# EAGLE design Modul sterujacy nastawnika (EAGLE 5.09)
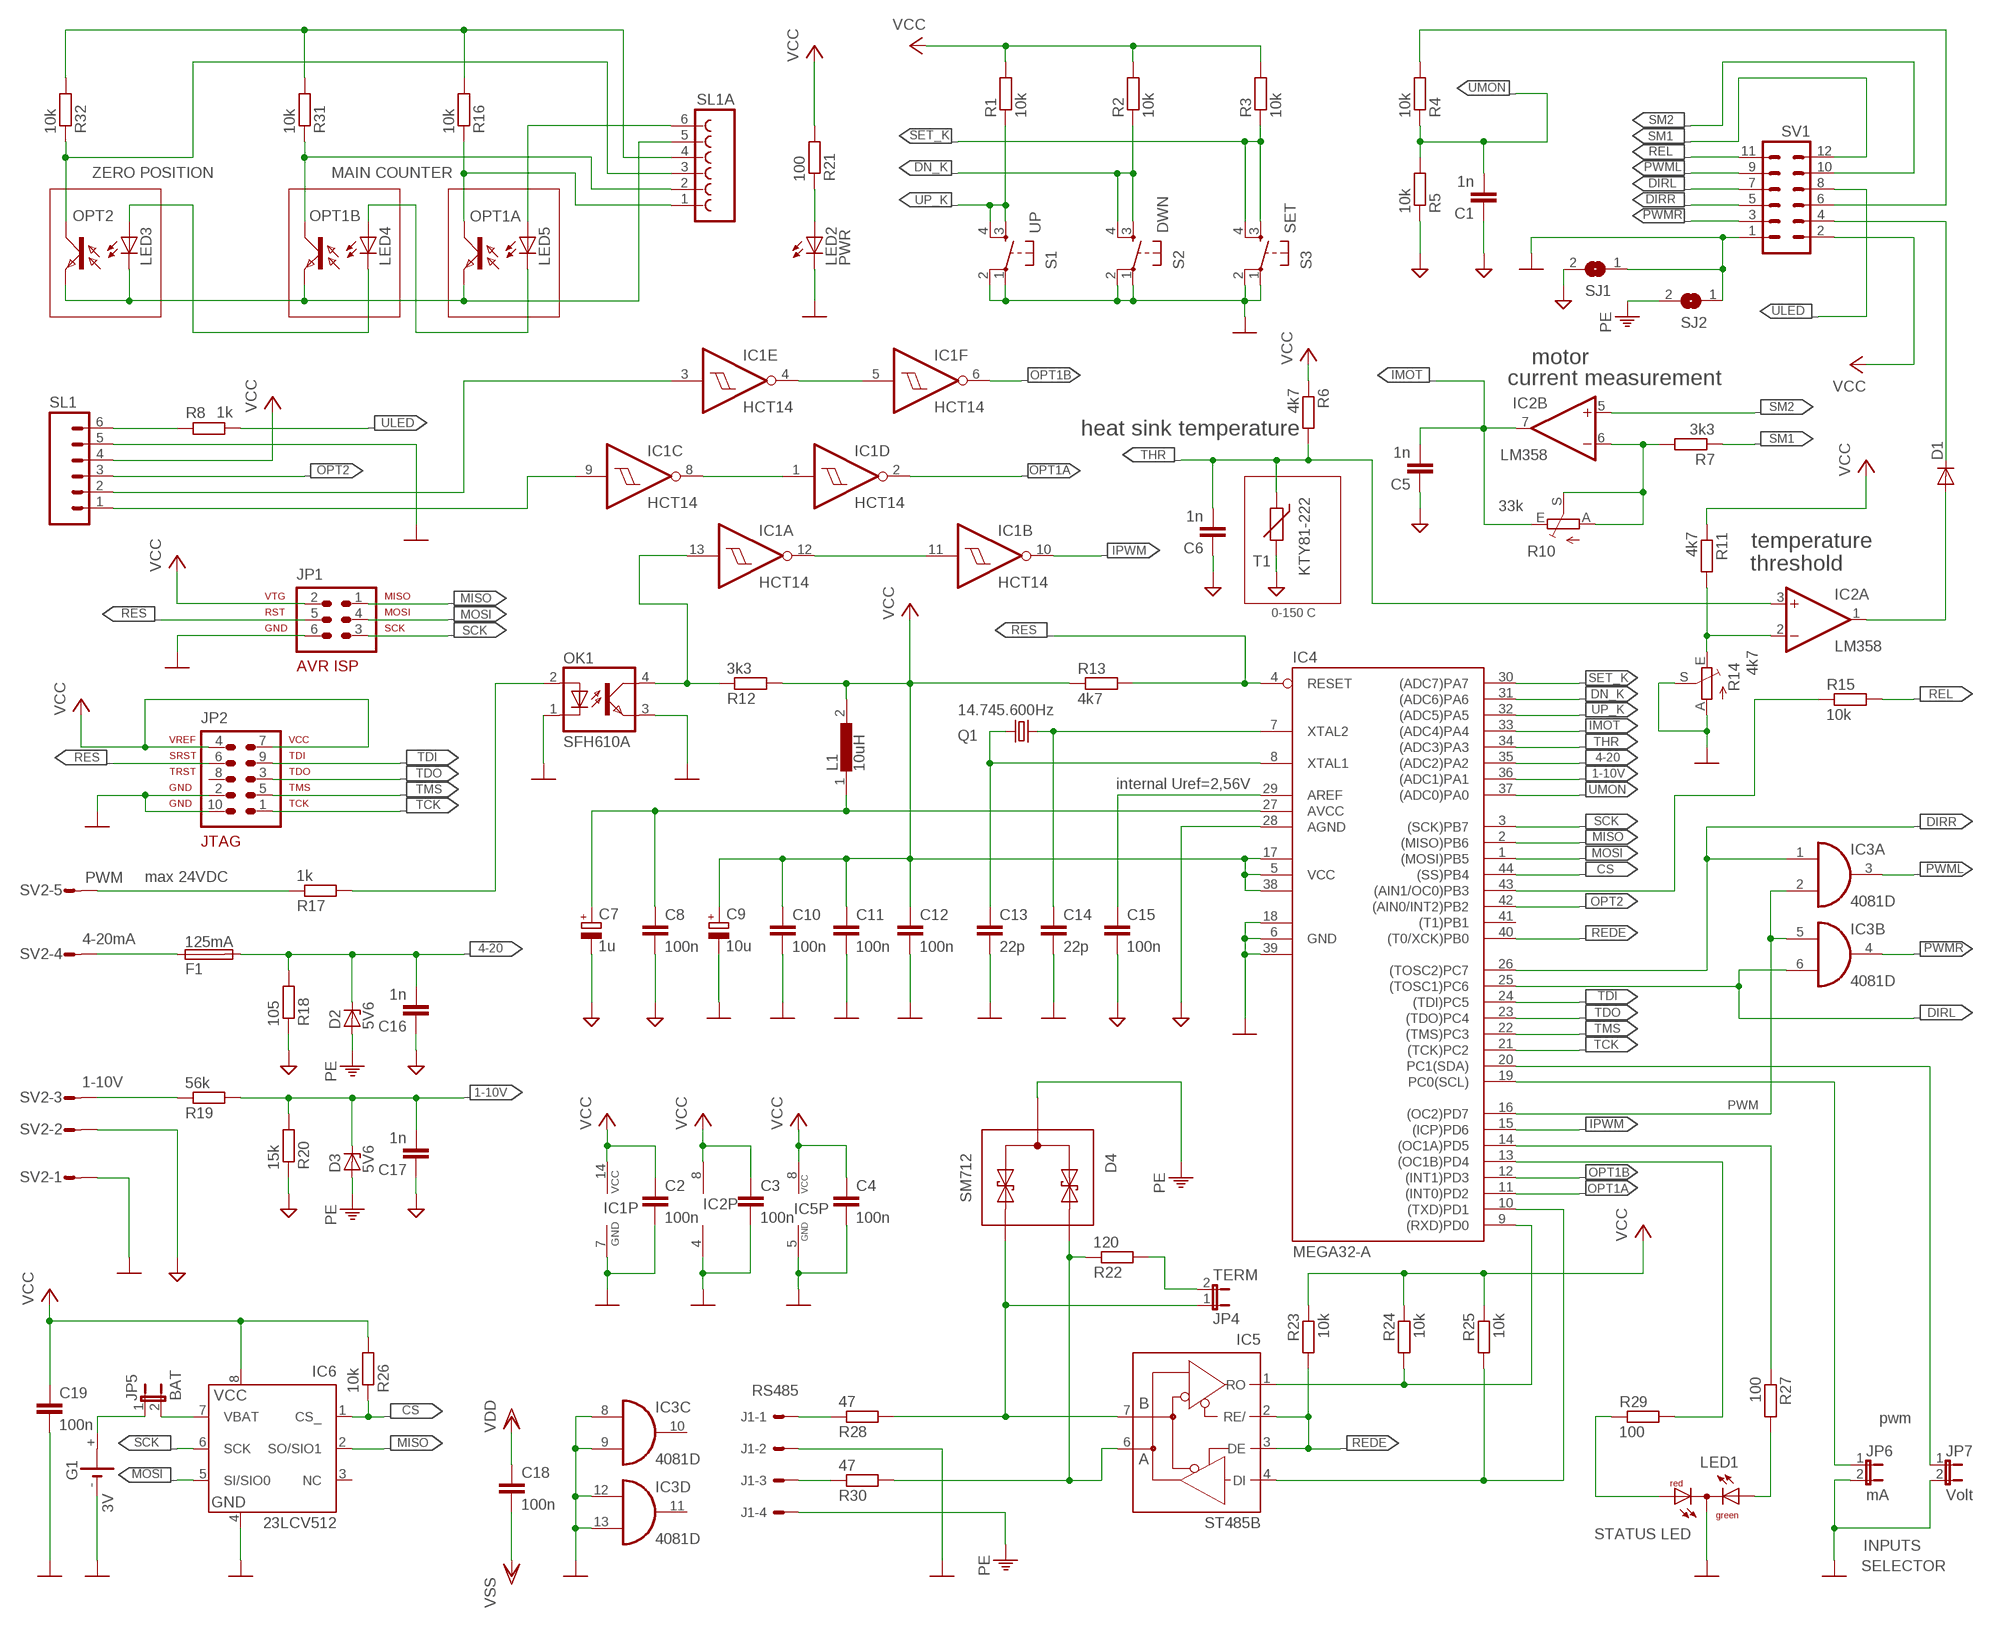
[diagram p0: schematic, sheet 1]

## Parts
C1  1n  C-EUC0805  [C0805]
C2  100n  C-EUC0805  [C0805]
C3  100n  C-EUC0805  [C0805]
C4  100n  C-EUC0805  [C0805]
C5  1n  C-EUC0805  [C0805]
C6  1n  C-EUC0805  [C0805]
C7  1u  CPOL-EUSMCP  [SMC_P]
C8  100n  C-EUC0805  [C0805]
C9  10u  CPOL-EUSMCC  [SMC_C]
C10  100n  C-EUC0805  [C0805]
C11  100n  C-EUC0805  [C0805]
C12  100n  C-EUC0805  [C0805]
C13  22p  C-EUC0805  [C0805]
C14  22p  C-EUC0805  [C0805]
C15  100n  C-EUC0805  [C0805]
C16  1n  C-EUC0805  [C0805]
C17  1n  C-EUC0805  [C0805]
C18  100n  C-EUC0805  [C0805]
C19  100n  C-EUC0805  [C0805]
D1  DIODE-MINIMELF  [MINIMELF]
D2  5V6  ZENER-DIODEMINIMELF  [MINIMELF]
D3  5V6  ZENER-DIODEMINIMELF  [MINIMELF]
D4  SM712  [SOT23]
F1  125mA  F6332  [R6332]
G1  CR2032V  [CR2032V]
IC1  HCT14  74AC14D  [SO14]
IC2  LM358  LM358D  [SO08]
IC3  4081D  [SO14]
IC4  MEGA32-A  [TQFP44]
IC5  ST485B  MAX481CSA  [SO08]
IC6  23LCV512  23LVC  [SO-08]
J1  22-27-2041-04  [6410-04]
JP1  AVR-ISP-6  [AVR-ISP-6]
JP2  AVR-JTAG-10  [AVR-JTAG-10]
JP4  TERM  JP1E  [JP1]
JP5  BAT  JP1E  [JP1]
JP6  mA  JP1E  [JP1]
JP7  Volt  JP1E  [JP1]
L1  10uH  1210  [C1210]
LED1  DUOLED-RG-C  [DUOLED-C-5MM]
LED2  PWR  LEDCHIPLED_1206  [CHIPLED_1206]
LED3  LEDIRL80A  [IRL80A]
LED4  LEDIRL80A  [IRL80A]
LED5  LEDIRL80A  [IRL80A]
OK1  SFH610A  SFH611  [DIL04]
OPT1A  LPT80A  [LPT80A]
OPT1B  LPT80A  [LPT80A]
OPT2  LPT80A  [LPT80A]
Q1  14.745.600Hz  CRYSTALSM49  [SM49]
R1  10k  R-EU_M0805  [M0805]
R2  10k  R-EU_M0805  [M0805]
R3  10k  R-EU_M0805  [M0805]
R4  10k  R-EU_R0805  [R0805]
R5  10k  R-EU_R0805  [R0805]
R6  4k7  R-EU_M0805  [M0805]
R7  3k3  R-EU_M0805  [M0805]
R8  1k  R-EU_M0805  [M0805]
R10  33k  TRIM_EU-B25P  [B25P]
R11  4k7  R-EU_M0805  [M0805]
R12  3k3  R-EU_M0805  [M0805]
R13  4k7  R-EU_M0805  [M0805]
R14  4k7  TRIM_EU-B25P  [B25P]
R15  10k  R-EU_M0805  [M0805]
R16  10k  R-EU_R0805  [R0805]
R17  1k  R-EU_M0805  [M0805]
R18  105  R-EU_M0805  [M0805]
R19  56k  R-EU_M0805  [M0805]
R20  15k  R-EU_M0805  [M0805]
R21  100  R-EU_M0805  [M0805]
R22  120  R-EU_M0805  [M0805]
R23  10k  R-EU_M0805  [M0805]
R24  10k  R-EU_M0805  [M0805]
R25  10k  R-EU_M0805  [M0805]
R26  10k  R-EU_M0805  [M0805]
R27  100  R-EU_M0805  [M0805]
R28  47  R-EU_M0805  [M0805]
R29  100  R-EU_M0805  [M0805]
R30  47  R-EU_M0805  [M0805]
R31  10k  R-EU_R0805  [R0805]
R32  10k  R-EU_R0805  [R0805]
S1  UP  DTS-6  [DTS-6]
S2  DWN  DTS-6  [DTS-6]
S3  SET  DTS-6  [DTS-6]
SJ1  SJ  [SJ]
SJ2  SJ  [SJ]
SL1  M06  [06P]
SL1A  F06  [06P]
SV1  MA06-2  [MA06-2]
SV2  S05P  [S05P]
T1  KTY81-222  THERMISTOR-2,5  [RS-2,5]

## Nets
1-10_I: R19.1 SV2.3
1-10V: C17.2 D3.C IC4.36((ADC1)PA1) R19.2 R20.2
4-20: C16.2 D2.C F1.2 IC4.35((ADC2)PA2) R18.2
4-20_I: F1.1 SV2.4
AGND: C1.1 C5.1 C6.1 C7.- C8.2 C15.2 C16.1 C17.1 IC4.28(AGND) R5.1 R18.1 R20.1 SJ1.2 SV2.2 T1.2
CS: IC4.44((SS)PB4) IC6.1(CS_) R26.1
DIRL: IC3.6(B:I1) IC4.25((TOSC1)PC6) SV1.7
DIRR: IC3.1(A:I0) IC4.26((TOSC2)PC7) SV1.5
DN_K: IC4.31((ADC6)PA6) R2.1 S2.3 S2.4
GND: C2.2 C3.2 C4.2 C9.- C10.2 C11.2 C12.2 C13.2 C14.2 C19.2 G1.- IC1.7(P:GND) IC2.4(P:V-) IC3.8(C:I0) IC3.9(C:I1) IC3.12(D:I0) IC3.13(D:I1) IC4.6(GND) IC4.18(GND1) IC4.39(GND2) IC5.5(GND) IC6.4(GND) J1.2 JP1.6 JP2.2 JP2.10 JP6.2 JP7.2 LED1.C LED2.C OK1.1(C) OK1.3(EMIT) R14.A R14.S S1.1 S1.2 S2.1 S2.2 S3.1 S3.2 SJ1.1 SJ2.1 SL1.5 SV1.1 SV2.1
IMOT: C5.2 IC2.7(B:OUT) IC4.33((ADC4)PA4) R10.E
IPWM: IC1.10(B:O) IC4.15((ICP)PD6)
MISO: IC4.2((MISO)PB6) IC6.2(SO/SIO1) JP1.1
MOSI: IC4.1((MOSI)PB5) IC6.5(SI/SIO0) JP1.4
N$1: IC4.43((AIN1/OC0)PB3) R15.1
N$2: IC2.6(B:-IN) R7.2 R10.A R10.S
N$3: R4.2 SV1.6
N$4: R17.1 SV2.5
N$5: LED3.A LED4.K(C)
N$6: J1.1 R28.1
N$7: LED5.A SL1A.6
N$8: IC1.9(C:I) SL1.1
N$11: D1.C SV1.4
N$12: J1.3 R30.1
N$14: JP4.2 R22.2
N$16: IC2.2(A:-IN) R11.2 R14.E
N$17: D4.1 IC5.7(B) JP4.1 R28.2
N$21: D4.2 IC5.6(A) R22.1 R30.2
N$22: IC4.20(PC1(SDA)) JP7.1
N$23: IC4.19(PC0(SCL)) JP6.1
N$24: IC4.14((OC1A)PD5) R27.1
N$26: LED1.AX(AG) R27.2
N$27: IC4.13((OC1B)PD4) R29.2
N$28: LED1.AR R29.1
N$33: C14.1 IC4.7(XTAL2) Q1.2
N$34: C7.+ C8.1 IC4.27(AVCC) L1.1
N$35: LED2.A R21.1
N$36: D1.A IC2.1(A:OUT)
N$37: C13.1 IC4.8(XTAL1) Q1.1
N$42: G1.+ JP5.1
N$43: IC1.11(B:I) IC1.12(A:O)
N$44: IC1.1(D:I) IC1.8(C:O)
N$45: IC1.3(E:I) SL1.2
N$46: IC1.4(E:O) IC1.5(F:I)
N$47: R8.1 SL1.6
N$48: R16.2 R31.2 R32.2 SL1A.4
N$49: OK1.2(A) R17.2
N$50: LED4.A LED5.K(C)
N$51: IC1.13(A:I) OK1.4(COL) R12.1
N$52: OPT1A.C R16.1 SL1A.1
N$53: OPT1B.C R31.1 SL1A.2
N$54: IC6.7(VBAT) JP5.2
N$55: OPT2.C R32.1 SL1A.3
N$56: IC4.10((TXD)PD1) IC5.4(DI) R25.2
N$58: LED3.K(C) OPT1A.E OPT1B.E OPT2.E SL1A.5
N$60: C15.1 IC4.29(AREF)
N$61: IC4.9((RXD)PD0) IC5.1(RO) R24.2
OPT1A: IC1.2(D:O) IC4.11((INT0)PD2)
OPT1B: IC1.6(F:O) IC4.12((INT1)PD3)
OPT2: IC4.42((AIN0/INT2)PB2) SL1.3
PE: D2.A D3.A D4.3 J1.4 SJ2.2
PWML: IC3.3(A:O) SV1.9
PWMO: IC3.2(A:I1) IC3.5(B:I0) IC4.16((OC2)PD7)
PWMR: IC3.4(B:O) SV1.3
REDE: IC4.40((T0/XCK)PB0) IC5.2(RE/) IC5.3(DE) R23.2
REL: R15.2 SV1.11
RES: IC4.4(RESET) JP1.5 JP2.6 R13.2
SCK: IC4.3((SCK)PB7) IC6.6(SCK) JP1.3
SET_K: IC4.30((ADC7)PA7) R3.1 S3.3 S3.4
SM1: R7.1 SV1.12
SM2: IC2.5(B:+IN) SV1.10
TCK: IC4.21((TCK)PC2) JP2.1
TDI: IC4.24((TDI)PC5) JP2.9
TDO: IC4.23((TDO)PC4) JP2.3
THR: C6.2 IC2.3(A:+IN) IC4.34((ADC3)PA3) R6.2 T1.1
TMS: IC4.22((TMS)PC3) JP2.5
ULED: R8.2 SV1.8
UMON: C1.2 IC4.37((ADC0)PA0) R4.1 R5.2
UP_K: IC4.32((ADC5)PA5) R1.1 S1.3 S1.4
VCC: C2.1 C3.1 C4.1 C9.+ C10.1 C11.1 C12.1 C19.1 IC1.14(P:VCC) IC2.8(P:V+) IC4.5(VCC) IC4.17(VCC1) IC4.38(VCC2) IC5.8(VCC) IC6.8(VCC) JP1.2 JP2.4 JP2.7 L1.2 R1.2 R2.2 R3.2 R6.1 R11.1 R12.2 R13.1 R21.2 R23.1 R24.1 R25.1 R26.2 SL1.4 SV1.2
VDD: C18.1
VSS: C18.2
Unconnected: G1.+@1(+) IC3.10(C:O) IC3.11(D:O) IC4.41((T1)PB1) IC6.3(NC) JP2.8

## Notes on the sheet
- ZERO POSITION | MAIN COUNTER
- motor
- current measurement
- heat sink temperature
- temperature
- threshold
- 0-150 C
- internal Uref=2,56V
- PWM | max 24VDC
- 4-20mA
- 1-10V
- PWM
- IC2P
- RS485
- pwm
- 3V
- STATUS LED
- INPUTS
- SELECTOR

## Power pins joined to a net without a drawn wire
VDD: IC3.14(P:VDD)
VSS: IC3.7(P:VSS)

## Library data of the parts
C1-C6 C8 C10-C19 = rcl:C-EU: CAPACITOR, European symbol
C7 C9 = rcl:CPOL-EU: POLARIZED CAPACITOR, European symbol
D1 = diode:DIODE-: DIODE
D2 D3 = diode:ZENER-DIODEMINIMELF
D4 = diode:SM712: Suppressor (TVS) diode - Asymmetrical TVS Diode for Extended Common-Mode RS-485
F1 = fuse:F6332
G1 = battery:CR2032V: LI BATTERY Varta
IC1 = 74xx-eu:74*14: Hex schmitt trigger INVERTER
IC2 = linear:LM358: OP AMP also LM158; LM258; LM2904 Source: http://cache.national.com/ds/LM/LM158.pdf
IC3 = 40xx:4081: Quad 2-input AND
IC4 = avr:MEGA32: MICROCONTROLLER 32 Kbytes FLASH 2 Kbytes SRAM 1 Kbytes EEPROM USART 8-channel 10 bit ADC
IC5 = maxim-7:MAX481CSA: RS485 TRANSEIVER
IC6 = microchip:23LVC: 512 Kbit SPI Serial SRAM with Battery Backup and SDI Interface
J1 = con-molex:22-?-04: CONNECTOR wire to board 2.54 mm (.1 inch) pitch header
JP1 = atmel1:AVR-ISP-6: AVR ISP-6 Serial Programming Header
JP2 = atmel1:AVR-JTAG-10: AVR JTAG Debug/Programming Header
JP4-JP7 = jumper:JP1E: JUMPER
L1 = inductors:1210
LED1 = led:DUOLED-RG-C: DUO LED 2 colors (red/green), 5 mm, round, common Cathode www.ligitek.com or other producers.
LED2-LED5 = led:LED: LED OSRAM: - CHIPLED LG R971, LG N971, LY N971, LG Q971, LY Q971, LO R971, LY R971 LH N974, LH R974 LS Q976, LO Q976, LY Q976 LO Q996 - Hyper CHIPLED LW Q18S LB Q993, LB Q99A, LB R99A - SideLED LS A670, LO A670, LY A670, LG A670, LP A670 LB A673, LV A673, LT A673, LW A673 LH A674 LY A675 LS A676, LA A676, LO A676, LY A676, LW A676 LS A679, LY A679, LG A679 - Hyper Micro SIDELED® LS Y876, LA Y876, LO Y876, LY Y876 LT Y87S - SmartLED LW L88C, LW L88S LB L89C, LB L89S, LG L890 LS L89K, LO L89K, LY L89K LS L896, LA L896, LO L896, LY L896 - TOPLED LS T670, LO T670, LY T670, LG T670, LP T670 LSG T670, LSP T670, LSY T670, LOP T670, LYG T670 LG T671, LOG T671, LSG T671 LB T673, LV T673, LT T673, LW T673 LH T674 LS T676, LA T676, LO T676, LY T676, LB T676, LH T676, LSB T676, LW T676 LB T67C, LV T67C, LT T67C, LS T67K, LO T67K, LY T67K, LW E67C LS E67B, LA E67B, LO E67B, LY E67B, LB E67C, LV E67C, LT E67C LW T67C LS T679, LY T679, LG T679 LS T770, LO T770, LY T770, LG T770, LP T770 LB T773, LV T773, LT T773, LW T773 LH T774 LS E675, LA E675, LY E675, LS T675 LS T776, LA T776, LO T776, LY T776, LB T776 LHGB T686 LT T68C, LB T68C - Hyper Mini TOPLED® LB M676 - Mini TOPLED Santana® LG M470 LS M47K, LO M47K, LY M47K Source: http://www.osram.convergy.de LUXEON: - LUMILED® LXK2-PW12-R00, LXK2-PW12-S00, LXK2-PW14-U00, LXK2-PW14-V00 LXK2-PM12-R00, LXK2-PM12-S00, LXK2-PM14-U00 LXK2-PE12-Q00, LXK2-PE12-R00, LXK2-PE12-S00, LXK2-PE14-T00, LXK2-PE14-U00 LXK2-PB12-K00, LXK2-PB12-L00, LXK2-PB12-M00, LXK2-PB14-N00, LXK2-PB14-P00, LXK2-PB14-Q00 LXK2-PR12-L00, LXK2-PR12-M00, LXK2-PR14-Q00, LXK2-PR14-R00 LXK2-PD12-Q00, LXK2-PD12-R00, LXK2-PD12-S00 LXK2-PH12-R00, LXK2-PH12-S00 LXK2-PL12-P00, LXK2-PL12-Q00, LXK2-PL12-R00 Source: www.luxeon.com KINGBRIGHT: KA-3528ASYC Source: www.kingbright.com
OK1 = optocoupler:SFH611: SIEMENS OPTO COUPLER
OPT1A OPT1B OPT2 = opto-trans-siemens:LPT80A: PHOTO TRANSISTOR
Q1 = crystal:CRYSTAL: CRYSTAL
R1-R8 R11-R13 R15-R32 = rcl:R-EU_: RESISTOR, European symbol
R10 R14 = pot:TRIM_EU-: POTENTIOMETER
S1-S3 = switch-tact1:DTS-6
SJ1 SJ2 = jumper:SJ: SMD solder JUMPER
SL1 = con-amp-quick:M06: AMP QUICK CONNECTOR
SL1A = con-amp-quick:F06: AMP QUICK CONNECTOR - female
SV1 = con-lstb:MA06-2: PIN HEADER
SV2 = con-amp-mt:S05P: AMP MT CONNECTOR
T1 = varistor:THERMISTOR: THERMISTOR

## Board
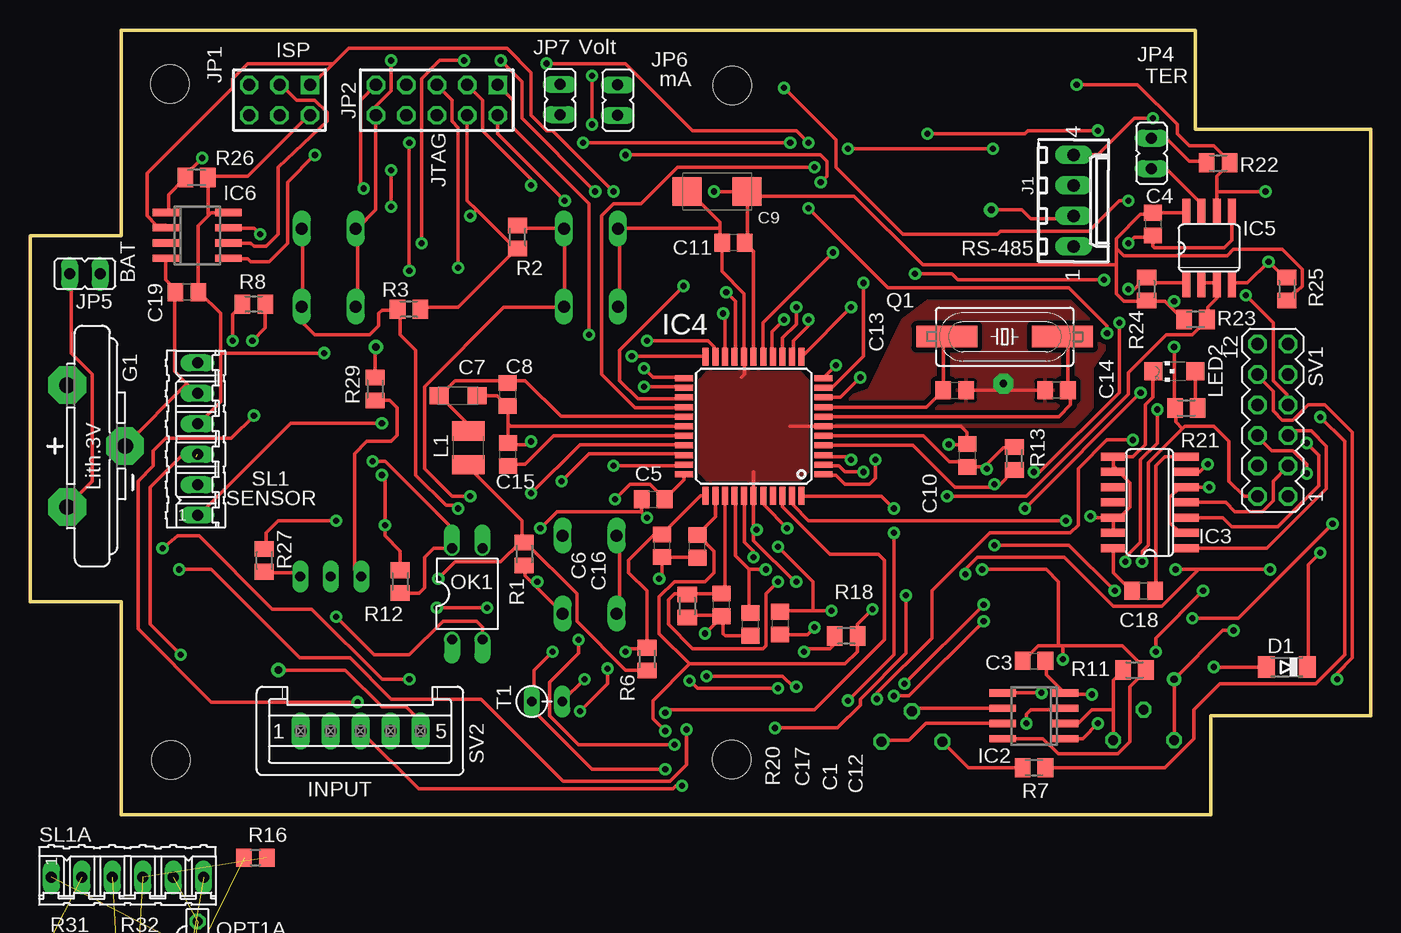
[diagram p1: board, top side]
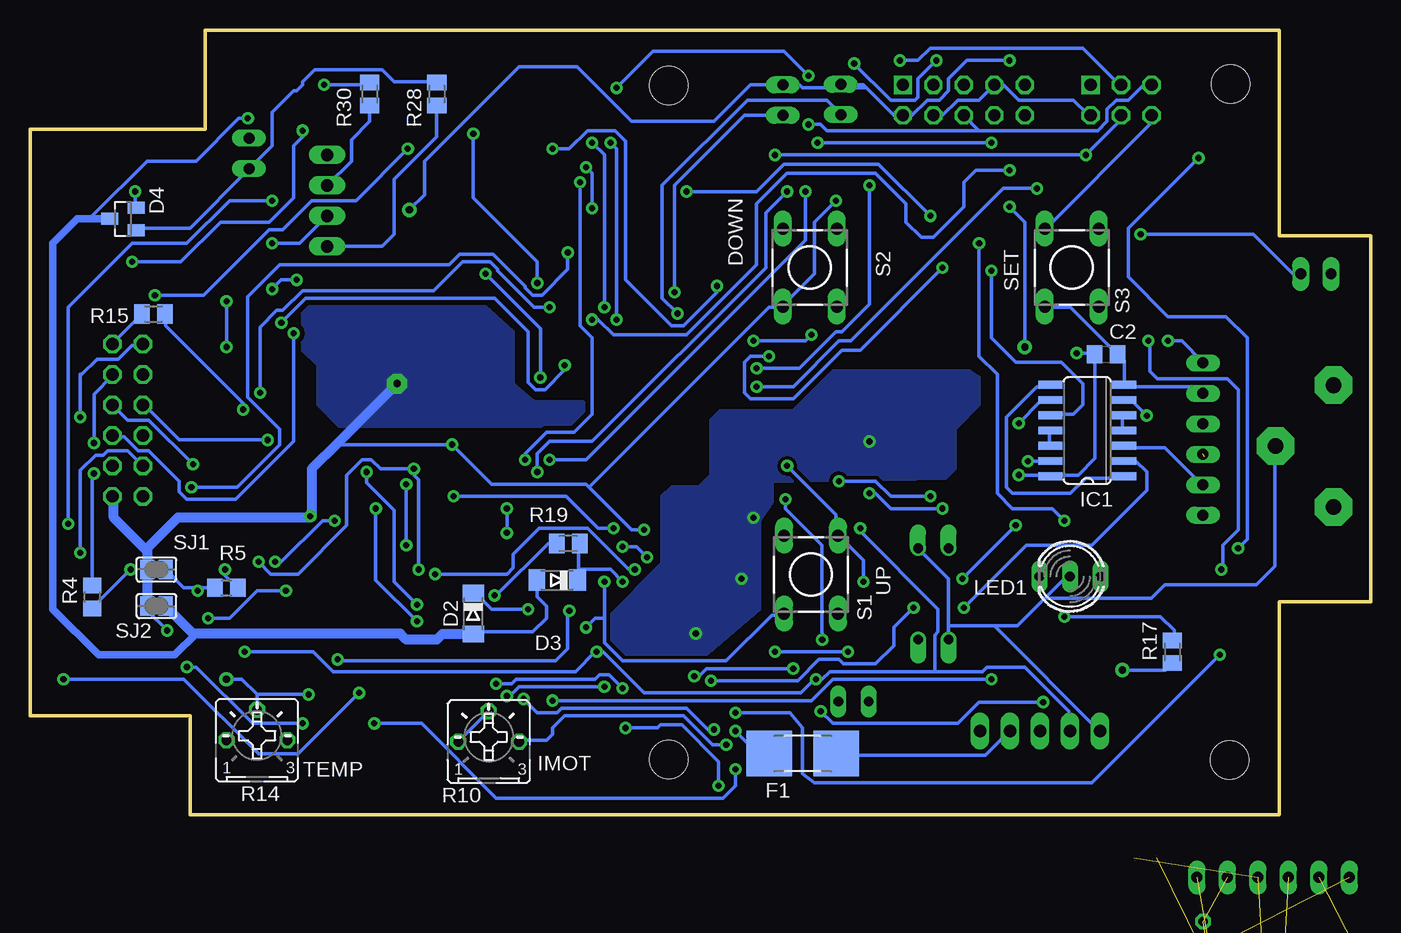
[diagram p2: board, bottom side, seen from below]

Size 111.76 x 65.53 mm. Coordinates in mm from the lower left corner, seen from the top.
Outline: 98.42,0.13 98.42,0
Outline: 98.42,0.13 7.62,0.13 7.62,17.91 0,17.91 0,48.39 7.62,48.39 7.62,65.53 97.16,65.53 97.16,57.28 111.76,57.28 111.76,8.38 98.42,8.38 98.42,0.13
Copper layers (1*16): Top 0.035mm / dielectric 1.55mm / Bottom 0.035mm
Design rules "cntr *": minimum track width 12mil, minimum drill 20mil, track to track 12mil, track to pad 10mil, pad to pad 8mil, via to via 12mil, smd to smd 8mil, copper to edge 40mil, drill to drill 20mil, minimum pad ring 10mil, minimum via ring 8mil, stop-mask expansion 4mil, vias tented up to drill 0mil, thermal gap 10mil
Holes 3.2 mm at 11.67,61.02 11.77,4.71 58.53,60.9 58.51,4.73
tRestrict: area 8.2,57.5 to 15.1,64.4; area 55.2,57.5 to 62.1,64.4; area 55.2,1.5 to 62.1,8.4; area 8.5,1.3 to 15.4,8.2

### Footprints (pad centres in the part's own frame; a part is rotated, then mirrored left to right if it is on the bottom)
C0805 = smd 1.3 x 1.5: 1 -0.95,0; 2 0.95,0
SMC_P = smd 1.6 x 1.4: + -1.575,0; - 1.575,0
SMC_C = smd 2.4 x 2.4: + -2.5,0; - 2.5,0
MINIMELF = smd 1.4 x 1.8: A 1.7,0; C -1.7,0
SOT23 = smd 1 x 1.4: 1 -0.95,-1.1; 2 0.95,-1.1; 3 0,1.1
R6332 = smd 3.81 x 3.81: 1 -2.8,0; 2 2.8,0
CR2032V = drill 1.321 pad 3.15 octagon: + -2.54,-5.08; +@1 -2.54,5.08; - 2.286,0
SO14 = smd 0.66 x 2.032: 1 -3.81,-3.073; 2 -2.54,-3.073; 3 -1.27,-3.073; 4 0,-3.073; 5 1.27,-3.073; 6 2.54,-3.073; 7 3.81,-3.073; 8 3.81,3.073; 9 2.54,3.073; 10 1.27,3.073; 11 0,3.073; 12 -1.27,3.073; 13 -2.54,3.073; 14 -3.81,3.073
SO08 = smd 0.6 x 2.2: 1 -1.905,-2.6; 2 -0.635,-2.6; 3 0.635,-2.6; 4 1.905,-2.6; 5 1.905,2.6; 6 0.635,2.6; 7 -0.635,2.6; 8 -1.905,2.6
TQFP44 = smd 1.5 x 0.5: 1 -5.8,4; 2 -5.8,3.2; 3 -5.8,2.4; 4 -5.8,1.6; 5 -5.8,0.8; 6 -5.8,0; 7 -5.8,-0.8; 8 -5.8,-1.6; 9 -5.8,-2.4; 10 -5.8,-3.2; 11 -5.8,-4; 23 5.8,-4; 24 5.8,-3.2; 25 5.8,-2.4; 26 5.8,-1.6; 27 5.8,-0.8; 28 5.8,0; 29 5.8,0.8; 30 5.8,1.6; 31 5.8,2.4; 32 5.8,3.2; 33 5.8,4 | smd 0.5 x 1.5: 12 -4,-5.8; 13 -3.2,-5.8; 14 -2.4,-5.8; 15 -1.6,-5.8; 16 -0.8,-5.8; 17 0,-5.8; 18 0.8,-5.8; 19 1.6,-5.8; 20 2.4,-5.8; 21 3.2,-5.8; 22 4,-5.8; 34 4,5.8; 35 3.2,5.8; 36 2.4,5.8; 37 1.6,5.8; 38 0.8,5.8; 39 0,5.8; 40 -0.8,5.8; 41 -1.6,5.8; 42 -2.4,5.8; 43 -3.2,5.8; 44 -4,5.8
SO08' = smd 0.66 x 2.032: 1 -1.905,-3.073; 2 -0.635,-3.073; 3 0.635,-3.073; 4 1.905,-3.073; 5 1.905,3.073; 6 0.635,3.073; 7 -0.635,3.073; 8 -1.905,3.073
SO-08 = smd 0.6 x 2.2: 1 -1.905,-2.6; 2 -0.635,-2.6; 3 0.635,-2.6; 4 1.905,-2.6; 5 1.905,2.6; 6 0.635,2.6; 7 -0.635,2.6; 8 -1.905,2.6
6410-04 = drill 1.016 long: 1 3.81,0; 2 1.27,0; 3 -1.27,0; 4 -3.81,0
AVR-ISP-6 = drill 1.016 square: 1 -2.54,-1.27 | drill 1.016 octagon: 2 -2.54,1.27; 3 0,-1.27; 4 0,1.27; 5 2.54,-1.27; 6 2.54,1.27
AVR-JTAG-10 = drill 1.016 square: 1 -5.08,-1.27 | drill 1.016 octagon: 2 -5.08,1.27; 3 -2.54,-1.27; 4 -2.54,1.27; 5 0,-1.27; 6 0,1.27; 7 2.54,-1.27; 8 2.54,1.27; 9 5.08,-1.27; 10 5.08,1.27
JP1 = drill 0.914 long: 1 0,-1.27; 2 0,1.27
C1210 = smd 1.6 x 2.7: 1 -1.4,0; 2 1.4,0
DUOLED-C-5MM = drill 0.813 long: AR 2.54,0; AX -2.54,0; C 0,0
CHIPLED_1206 = smd 1.5 x 1.5: A 0,-1.75; C 0,1.75
IRL80A = drill 0.813 octagon: A 0,-1.27; K 0,1.27
DIL04 = drill 0.813 offset: 1 -1.27,-3.81; 2 1.27,-3.81; 3 1.27,3.81; 4 -1.27,3.81
LPT80A = drill 0.813 octagon: C 0,-1.27; E 0,1.27
SM49 = smd 5.08 x 1.778: 1 -4.826,0; 2 4.826,0
M0805 = smd 1.3 x 1.6: 1 -0.95,0; 2 0.95,0
R0805 = smd 1.3 x 1.5: 1 -0.95,0; 2 0.95,0
B25P = drill 0.813 octagon: A -2.54,0; E 2.54,0; S 0,2.54
DTS-6 = drill 1 long: 1 -3.25,2.25; 2 3.25,2.25; 3 -3.25,-2.25; 4 3.25,-2.25
SJ = smd 1.168 x 1.6: 1 -0.762,0; 2 0.762,0
06P = drill 0.914 long: 1 -6.35,0; 2 -3.81,0; 3 -1.27,0; 4 1.27,0; 5 3.81,0; 6 6.35,0
MA06-2 = drill 1.016 octagon: 1 -6.35,-1.27; 2 -6.35,1.27; 3 -3.81,-1.27; 4 -3.81,1.27; 5 -1.27,-1.27; 6 -1.27,1.27; 7 1.27,-1.27; 8 1.27,1.27; 9 3.81,-1.27; 10 3.81,1.27; 11 6.35,-1.27; 12 6.35,1.27
S05P = drill 1.016 long: 1 5,0; 2 2.5,0; 3 0,0; 4 -2.5,0; 5 -5,0
RS-2,5 = drill 0.813 long: 1 -1.27,0; 2 1.27,0

### Placement (x,y rotation side)
C1  60.07,16 90 top
C2  22.05,38.51 0 bottom
C3  83.69,12.95 0 top
C4  93.62,49.35 270 top
C5  51.94,26.42 0 top
C6  52.71,22.56 90 top
C7  35.69,35.05 0 top
C8  39.8,35.15 270 top
C9  57.28,52.07 180 top
C10  78.16,30.07 90 top
C11  58.65,47.8 180 top
C12  62.51,16.1 270 top
C13  77.09,35.51 0 top
C14  85.57,35.51 180 top
C15  39.85,30.15 90 top
C16  55.63,22.5 90 top
C17  57.63,17.63 90 top
C18  92.84,18.8 0 top
C19  13.08,43.69 180 top
D1  104.77,12.45 180 top
D2  74.8,16.89 270 bottom
D3  67.82,19.68 180 bottom
D4  104.01,49.78 90 bottom
F1  47.35,5.23 180 bottom
G1  5.64,30.86 0 top
IC1  23.62,32.16 90 bottom
IC2  83.69,8.38 90 top
IC3  93.34,26.16 90 top
IC4  60.33,32.51 180 top
IC5  ST485B  [SO08']  98.3,47.37 0 top
IC6  13.94,48.41 270 top
J1  86.99,51.31 270 top
JP1  20.8,59.69 180 top
JP2  33.91,59.69 180 top
JP4  93.5,55.24 0 top
JP5  4.57,45.21 270 top
JP6  49,59.69 0 top
JP7  44.17,59.74 0 top
L1  36.53,30.71 270 top
LED1  25.07,19.99 180 bottom
LED2  95.38,37.08 90 top
LED3  2.41,-26.67 0 top  (outside the outline)
LED4  2.29,-21.72 0 top  (outside the outline)
LED5  11.3,-21.72 0 top  (outside the outline)
OK1  36.45,18.54 0 top
OPT1A  13.97,-10.03 0 top  (outside the outline)
OPT1B  2.29,-16.76 0 top  (outside the outline)
OPT2  12.95,-16.76 0 top  (outside the outline)
Q1  81.25,39.98 0 top
R1  41.2,21.87 90 top
R2  40.64,48.29 270 top
R3  31.6,42.27 0 top
R4  106.55,18.29 90 bottom
R5  95.38,19.05 0 bottom
R6  51.44,13.11 90 top
R7  83.69,4.06 180 top
R8  18.67,42.67 0 top
R10  73.52,6.23 0 bottom
R11  92.07,12.19 180 top
R12  30.86,19.56 90 top
R13  82.07,29.82 270 top
R14  92.84,6.35 0 bottom
R15  101.47,41.86 180 bottom
R16  18.8,-3.43 0 top  (outside the outline)
R17  16.54,13.72 90 bottom
R18  68.05,15.04 0 top
R19  66.88,22.73 0 bottom
R20  54.79,17.53 90 top
R21  96.39,34.04 180 top
R22  99.03,54.46 180 top
R23  97.16,41.4 0 top
R24  93.09,43.94 90 top
R25  104.77,43.94 90 top
R26  13.89,53.24 0 top
R27  19.53,21.34 270 top
R28  77.85,60.2 90 bottom
R29  28.78,35.61 90 top
R30  83.44,60.2 90 bottom
R31  2.29,-10.92 0 top  (outside the outline)
R32  8.13,-10.92 0 top  (outside the outline)
S1  46.66,20.14 90 bottom
S2  46.76,45.73 90 bottom
S3  24.91,45.73 90 bottom
SJ1  101.22,20.57 0 bottom
SJ2  101.22,17.53 0 bottom
SL1  13.97,31.45 90 top
SL1A  8.13,-5.08 0 top  (outside the outline)
SV1  103.61,33.02 90 top
SV2  27.56,7.11 180 top
T1  43.1,9.58 0 top

### Tracks (layer width: path | path; a pad name or v marks a point on that pad's centre or on a via)
1-10_I  (via drill 0.51)
  Top 0.305: v73.02,18.41 73.02,13.59 69.22,9.78 69.22,9.27 67.31,7.37 v62.1,7.37 | v54.36,2.54 53.85,2.54 53.59,2.29 32.38,2.29 SV2.3
  Bottom 0.305: v73.02,18.41 72.9,18.41 68.58,22.73 R19.1 | v62.1,7.37 59.44,7.37 59.18,7.62 57.4,7.62 54.36,4.57 v54.36,2.54
1-10V  (via drill 0.51)
  Top 0.305: v62.36,19.56 61.34,18.54 61.34,14.22 61.09,13.97 55.25,13.97 53.21,16 53.21,18.03 53.72,18.54 54.72,18.54 R20.2 54.99,18.54 57.53,18.54 C17.2 57.93,18.87 IC4.36
  Bottom 0.305: R19.2 66.04,22.73 66.04,19.68 D3.C 65.91,20.57 63.37,20.57 v62.36,19.56
4-20  (via drill 0.51)
  Top 0.305: IC4.35 57.12,24.95 C16.2 55.75,23.37 57.02,22.1 57.02,20.32 56.26,19.56 53.72,19.56 52.45,18.29 52.45,15.24 54.99,12.7 | R18.2 69.47,14.99 | v52.96,7.11 51.94,8.13 51.94,9.65 54.99,12.7 | 54.99,12.7 67.94,12.7 68.96,13.72 68.96,15 R18.2 | v70.23,17.27 68.96,16 68.96,15.07 R18.2
  Bottom 0.305: v70.23,17.27 73.28,17.27 74.8,18.8 D2.C | v52.96,7.11 51.18,5.33 50.16,5.33 F1.2
4-20_I
  Bottom 0.305: SV2.4 30.1,7.11 32.13,5.08 44.32,5.08 F1.1
AGND  (via drill 0.51)
  Top 0.305: 39.85,32.71 39.85,34.15 C8.2 38.95,35.05 C7.- | 39.85,32.71 40.06,32.51 IC4.28 54.61,32.38 | 39.85,32.71 C15.2 39.75,30.99 41.53,30.99 v41.78,31.24 | 52.71,21.59 55.5,21.59 C16.1 | C17.1 57.53,16.76 54.99,16.76 R20.1 | 52.71,21.59 C6.1 | 67.44,14.99 R18.1 66.93,14.87 66.93,14.22 66.67,13.97 64.52,13.97 v64.52,13.72 | 50.99,25.33 C5.1 | 50.99,25.33 v51.44,24.89 | 52.71,21.59 52.71,20.07 v52.45,19.81 | C17.1 57.63,16.61 v56.26,15.24 | C17.1 57.79,16.64 | v46.23,11.43 T1.2 | v97.79,18.8 93.85,14.86 v93.85,13.72 | v42.55,24 43.94,25.4 50.93,25.4 50.99,25.33 | C1.1 57.97,15.05 57.79,15.24 57.79,16.52 C17.1
  Bottom 0.305: 97.79,19.05 98.93,19.05 SJ1.2 | 97.79,19.05 R5.1 | 36.32,12.07 32.38,12.07 32,12.45 28.83,12.45 25.15,8.76 25.15,7.11 SV2.2 | 36.32,12.07 45.09,12.07 45.72,11.43 v46.23,11.43 46.36,11.43 47.5,10.29 60.58,10.29 64.01,13.72 v64.52,13.72 64.64,13.72 66.29,12.07 86.49,12.07 88.14,13.72 v93.85,13.72 | v97.79,18.8 97.79,19.05 | v42.55,24 42.55,23.75 36.07,17.27 36.07,15.37 36.32,15.11 36.32,12.07
  pour Bottom: 32.64,36.58 32.64,34.29 34.67,32.26 34.67,28.96 35.43,28.19 49.91,27.94 49.91,26.16 50.93,24.64 50.93,17.27 56.26,12.7 62.87,12.7 63.63,13.72 63.63,16.51 59.05,21.08 59.05,26.67 58.29,27.43 56.01,27.43 54.99,28.45 54.99,33.02 54.23,33.78 48.13,33.78 44.83,37.08 33.4,37.08
CS  (via drill 0.51)
  Top 0.305: v72.01,23.62 72.01,13.46 v68.2,9.65 | v31.62,11.43 29.34,11.43 23.5,17.27 20.19,17.27 14.1,23.37 12.32,23.37 v11.05,22.35 | v14.35,54.86 12.83,53.34 R26.1 12.83,53.09 11.56,51.82 11.56,50.55 IC6.1 | IC4.44 64.39,26.67 70.99,26.67 v72.01,25.65
  Bottom 0.305: v72.01,23.62 v72.01,25.65 | v68.2,9.65 46.61,9.65 44.83,11.43 v31.62,11.43 | v14.35,54.86 20.19,49.02 20.19,44.96 16.89,41.66 12.07,41.66 10.29,39.88 10.29,23.11 v11.05,22.35
DIRL  (via drill 0.51)
  Top 0.305: v54.48,44.2 49.15,38.86 49.15,36.32 50.67,34.8 54.48,34.8 IC4.25 | v98.17,29.34 97.54,28.7 IC3.6 | v101.35,43.43 103.63,41.15 103.63,36.32 104.77,35.18 104.77,34.29 SV1.7 | v68.2,55.63 v80.26,55.63
  Bottom 0.305: v54.48,44.2 54.48,43.69 57.28,40.89 58.29,40.89 62.1,44.7 62.1,56.26 62.99,57.15 65.28,57.15 66.8,55.63 v68.2,55.63 | v98.17,29.34 101.85,33.02 103.63,33.02 104.77,34.16 SV1.7 | v101.35,43.43 97.28,43.43 91.82,48.9 90.68,48.9 88.27,51.31 84.58,51.31 v80.26,55.63
DIRR  (via drill 0.51)
  Top 0.305: v65.41,54.1 53.98,54.1 50.93,51.05 48.64,51.05 47.62,50.04 47.62,36.83 50.42,34.04 54.48,34.04 IC4.26 | IC3.1 103.12,22.35 108.08,27.3 108.08,30.86 106.81,32.13 105.28,32.13 104.9,31.75 SV1.5 | v89.79,40.26 89.79,40.89 86.61,44.07 71.5,44.07 v64.9,50.67
  Bottom 0.305: v89.79,40.26 89.79,31.24 94.61,26.42 98.68,26.42 99.31,27.05 99.31,27.94 101.85,30.48 102.74,30.48 103.89,31.62 104.77,31.62 SV1.5 | v64.9,50.67 64.9,53.59 v65.41,54.1
DN_K  (via drill 0.51)
  Top 0.305: R2.1 40.77,49.02 44.32,49.02 S2.4 44.58,48.77 44.58,42.67 S2.3 44.32,42.42 39.5,42.42 32.89,35.81 32.89,28.96 35.18,26.67 v36.7,26.67 | v44.32,27.94 46.61,30.23 54.48,30.23 IC4.31
  Bottom 0.305: v44.32,27.94 41.28,27.94 40.01,26.67 v36.7,26.67
GND  (via drill 0.51, 0.6, 0.6 pad 1.68)
  Top 0.305: 60.33,23.88 60.33,22.99 63.82,19.5 v63.88,19.56 | 60.33,23.88 IC4.39 60.33,28.7 | C4.2 93.71,48.4 | IC5.5 100.2,48.01 99.57,47.37 93.73,47.37 93.6,47.5 93.6,48.38 C4.2 | 59.56,38.1 59.56,36.83 59.31,36.58 | 59.56,38.1 59.56,38.35 | 63.37,32.51 IC4.6 77.6,32.51 78.1,32 78.1,31.07 C10.2 78.12,30.99 v76.58,30.99 | 81.71,35.51 C13.2 | 81.71,35.51 C14.2 | v81.15,36.07 81.71,35.51 | IC6.4 11.3,46.47 11.3,44.7 12.13,43.88 C19.2 12.07,43.69 12.07,37.08 13.08,36.07 | S3.1 27.3,42.67 27.3,48.77 S3.2 27.3,49.02 28.83,50.55 JP2.10 28.83,59.18 30.1,60.45 v30.1,62.99 | 13.08,36.07 13.84,35.31 SL1.5 | 13.08,36.07 8,30.99 G1.- | S1.1 49.15,17.02 49.15,23.37 S1.2 | v60.58,23.88 60.33,23.88 | J1.2 86.74,49.78 83.44,49.78 82.68,50.55 v80.14,50.55 | v91.57,47.75 92.07,48.26 93.09,48.26 C4.2 | S2.1 49.15,42.67 49.15,48.77 S2.2 49.15,49.02 57.53,49.02 | 59.56,38.1 IC4.18 59.53,43.57 57.68,45.41 57.68,47.79 C11.2 57.53,48.01 57.53,49.02 | 57.53,49.02 57.53,49.53 54.99,52.07 C9.- | JP2.2 38.99,56.9 v44.58,51.31 | C3.2 84.71,12.95 84.71,11.81 86.23,10.29 IC2.4 86.36,10.16 v88.52,10.16 | IC3.13 90.3,23.62 90.3,24.89 IC3.12 | 90.3,29.08 90.3,29.97 IC3.8 91.95,29.97 92.96,30.99 92.96,34.29 93.6,34.92 93.6,37.08 LED2.C | 90.3,29.08 90.3,28.7 IC3.9 | IC3.12 90.8,24.89 91.69,25.78 91.69,27.81 90.42,29.08 90.3,29.08 | v88.39,25.02 88.52,24.89 IC3.12 | C12.2 64.81,15.15 v65.41,15.75 | v100.33,15.49 99.44,15.49 v95.38,11.43 R14.A
  Bottom 0.305: JP1.6 18.41,58.42 18.41,57.66 27.05,49.02 S3.2 | SL1.5 14.1,35.31 14.61,35.81 20.45,35.81 IC1.7 20.55,37.96 C2.2 21.21,38.61 25.02,42.42 27.05,42.42 S3.1 | 8,30.73 G1.- 8,30.61 8,20.83 9.53,19.3 17.15,19.3 18.29,18.16 27.05,18.16 27.12,18.22 | S1.1 49.15,16.76 49.91,16.76 53.72,12.95 62.36,12.95 63.88,14.48 63.88,16.51 | 86.11,31.12 85.98,30.99 v76.58,30.99 73.28,27.69 65.41,27.69 65.15,27.43 | v60.58,23.88 61.6,23.88 65.15,27.43 | v91.57,47.75 89.28,47.75 J1.2 | 42.04,60.71 39.75,58.42 JP2.2 38.23,58.42 36.96,59.69 35.94,59.69 35.18,60.45 35.18,61.47 33.66,62.99 v30.1,62.99 | 42.04,60.71 42.29,60.96 44.07,60.96 JP7.2 | 42.04,60.71 47.37,60.71 47.62,60.96 JP6.2 51.69,60.96 54.74,57.91 61.6,57.91 66.17,62.48 70.99,62.48 78.87,54.61 78.87,51.82 v80.14,50.55 | v44.58,51.31 46.36,49.53 46.36,45.21 48.9,42.67 S2.1 49.15,42.42 50.16,42.42 65.15,27.43 | 35.18,15.88 35.18,19.81 OK1.3 | 35.18,15.88 OK1.1 | 27.12,18.22 29.46,15.88 31.24,15.88 | 27.12,18.22 25.4,19.94 25.15,19.94 LED1.C | 31.24,15.88 35.18,15.88 | SV2.1 22.61,7.11 31.24,15.75 31.24,15.88 | v100.33,15.49 101.98,17.14 SJ2.1 | v63.88,19.56 63.88,16.51 | 63.88,16.51 64.64,16.51 v65.41,15.75 | 92.84,10.16 v88.52,10.16 | 92.84,10.16 94.11,11.43 v95.38,11.43 | 92.84,10.16 R14.S
  Bottom 0.61: 101.98,22.35 102.11,22.23
  Bottom 0.813: v81.15,36.07 86.11,31.12 88.27,28.96 88.27,25.15 v88.39,25.02 88.52,24.89 99.44,24.89 101.98,22.35 | SJ2.1 SJ1.1 101.98,22.1 102.11,22.23 104.77,24.89 104.77,26.57 SV1.1
  pour Top (isolate 0.406): 55.88,35.69 55.88,28.7 56.52,28.07 64.14,28.07 64.77,28.7 64.77,36.32 64.14,36.96 56.52,36.96 55.88,36.32
  pour Bottom (isolate 0.406): 71.5,40.39 71.5,36.07 69.72,34.54 65.66,34.54 65.41,34.29 65.41,32.77 65.66,32.51 85.98,32.51 87.76,34.29 87.76,37.59 89.03,38.86 89.03,41.91 88.01,42.93 74.3,42.93
  pour Top (isolate 0.406): 67.18,34.54 69.98,35.56 72.77,41.4 74.8,42.93 88.27,42.93 89.53,41.66 89.53,38.86 88.52,37.34 88.52,34.04 87.25,32.51 67.18,32.51
IMOT  (via drill 0.51)
  Top 0.305: IC4.33 54.53,28.05 C5.2 52.83,26.54 51.69,27.69 50.04,27.69 v48.77,26.42 | v45.72,14.73 45.72,13.59 43.31,11.18 43.31,8.38 45.72,5.97 v53.72,5.97 | IC2.7 74.68,7.75 73.28,6.35 71.1,6.35 R10.E
  Bottom 0.305: v48.77,26.42 48.77,25.65 45.72,22.61 v45.72,14.73 | v53.72,5.97 54.86,5.97 57.28,8.38 67.18,8.38 68.2,7.37 68.2,6.86 68.71,6.35 70.86,6.35 R10.E
IPWM  (via drill 0.51)
  Top 0.305: v62.87,41.4 61.85,40.39 61.85,38.35 IC4.15 | v46.1,56.13 v63.37,56.13 | v31.62,45.47 v31.62,56.13
  Bottom 0.305: v62.87,41.4 62.87,55.63 v63.37,56.13 | v31.62,56.13 v46.1,56.13 | IC1.10 26.54,33.53 24.77,33.53 24,34.29 24,36.07 25.78,37.85 29.59,37.85 31.62,39.88 v31.62,45.47
MISO  (via drill 0.51)
  Top 0.305: v69.47,28.7 67.94,28.7 67.44,29.21 66.17,29.21 IC4.2 | v48.64,52.07 43.56,57.15 43.05,57.15 41.78,58.42 41.78,61.98 39.75,64.01 26.54,64.01 25.27,62.74 | 25.27,62.74 23.5,60.96 JP1.1 | 25.27,62.74 18.16,62.74 16.89,61.47 16.89,60.71 9.78,53.59 9.78,50.04 10.54,49.28 11.3,49.28 IC6.2
  Bottom 0.305: v69.47,28.7 69.47,30.23 68.45,31.24 64.9,31.24 50.42,45.72 50.42,50.29 v48.64,52.07
MOSI  (via drill 0.51)
  Top 0.305: v70.48,29.72 70.48,28.19 69.98,27.69 67.94,27.69 67.18,28.45 66.17,28.45 IC4.1 | v65.91,52.83 66.42,53.34 66.42,54.61 65.91,55.12 v49.66,55.12 | v23.75,55.12 21.46,52.83 21.46,47.75 19.94,46.23 18.41,46.23 18.16,46.48 16.64,46.48 IC6.5
  Bottom 0.305: v70.48,29.72 70.48,30.23 68.71,32 66.42,32 64.9,33.53 64.9,39.88 65.91,40.89 v65.91,52.83 | v49.66,55.12 v23.75,55.12 20.95,57.91 20.95,58.42 JP1.4
N$1  (via drill 0.51)
  Top 0.305: v86.36,24.64 64.9,24.64 63.63,25.91 63.63,26.67 IC4.43 | v91.31,21.21 91.31,21.59 92.58,22.86 92.58,29.72 93.98,31.12 v93.98,33.91
  Bottom 0.305: v86.36,24.64 87.38,24.64 90.8,21.21 v91.31,21.21 | v93.98,33.91 93.98,34.42 100.46,40.89 100.46,41.78 R15.1
N$2
  Top 0.305: R7.2 78.22,4.06 R10.A | IC2.6 73.77,9.02 R10.S
  Bottom 0.305: R10.S R10.A
N$3  (via drill 0.51)
  Top 0.305: v106.43,28.57 106.43,29.34 105.28,30.48 103.5,30.48 102.36,31.62 SV1.6
  Bottom 0.305: v106.43,28.57 106.55,28.45 R4.2
N$4  (via drill 0.6)
  Top 0.305: SV2.5 32.56,7.95 31.37,9.14 29.34,9.14 26.29,12.19 v20.7,12.19
  Bottom 0.305: v20.7,12.19 17.11,12.19 R17.1
N$5  (1 unrouted)
N$6
  Bottom 0.305: R28.1 77.85,56.64 81.41,53.09 81.41,48.51 82.42,47.5 J1.1
N$7  (1 unrouted)
N$8  (via drill 0.51)
  Top 0.305: v29.34,32.77 21.72,32.77 14.1,25.15 SL1.1
  Bottom 0.305: v29.34,32.77 27.56,34.54 26.8,34.54 IC1.9
N$11  (via drill 0.51)
  Top 0.305: v107.57,21.97 106.55,20.96 106.55,12.45 D1.C
  Bottom 0.305: v107.57,21.97 107.57,28.83 106.3,30.1 105.66,30.1 105.28,30.48 103.63,30.48 102.36,29.21 SV1.4
N$12
  Top 0.305: 86.74,52.32 J1.3
  Bottom 0.305: J1.3 84.96,54.61 84.96,56.39 83.44,57.91 R30.1
N$14
  Top 0.305: R22.2 97.92,54.61 96.65,54.61 94.87,56.39 93.6,56.39 JP4.2
N$16
  Top 0.305: 91.06,12.19 R11.2 90.3,11.36 90.3,8.89 | IC2.2 87.38,7.75 88.52,8.89 90.3,8.89 | 90.3,8.89 R14.E
N$17
  Top 0.305: IC5.7 97.66,51.05 94.87,53.85 93.6,53.85 JP4.1
  Bottom 0.305: R28.2 77.85,61.21 81.41,61.21 82.42,62.23 88.01,62.23 89.03,61.21 89.03,60.96 89.53,60.45 89.79,60.45 91.57,58.67 91.57,55.88 93.34,54.1 JP4.1 93.6,53.85 98.42,49.02 102.74,49.02 D4.1
N$21  (via drill 0.51)
  Top 0.305: v87.25,60.96 92.33,60.96 95.63,57.66 95.63,56.9 96.65,55.88 98.68,55.88 99.95,54.61 R22.1 99.95,54.36 98.93,53.34 98.93,52.07 | 98.93,52.07 IC5.6 | 98.93,52.07 v103,52.07
  Bottom 0.305: v103,52.07 103,50.8 D4.2 | v87.25,60.96 83.44,60.96 R30.2
N$22  (via drill 0.51)
  Top 0.305: IC4.20 57.93,41.77 v57.79,41.91
  Bottom 0.305: v57.79,41.91 59.05,43.18 59.05,52.58 51.94,59.69 45.34,59.69 44.32,58.67 JP7.1
N$23  (via drill 0.51)
  Top 0.305: v58.04,43.69 58.8,42.93 58.8,38.35 IC4.19
  Bottom 0.305: v58.04,43.69 58.04,52.58 52.2,58.42 JP6.1
N$24  (via drill 0.51)
  Top 0.305: v64.9,56.13 63.88,57.15 55.25,57.15 49.66,62.74 v43.05,62.74 | v36.2,62.99 34.16,62.99 32.64,61.47 v32.64,47.75 | R27.1 19.69,22.35 19.69,23.62 20.7,24.64 v25.53,24.64 | v63.88,42.42 63.88,41.02 62.74,39.88 62.74,38.35 IC4.14
  Bottom 0.305: v63.88,42.42 63.88,55.12 v64.9,56.13 | v43.05,62.74 40.01,59.69 37.97,59.69 37.72,59.94 37.72,61.47 v36.2,62.99 | v32.64,47.75 32.64,38.35 31.12,36.83 31.12,26.92 29.84,25.65 26.54,25.65 v25.53,24.64
N$26
  Top 0.305: R27.2 19.69,20.32 22.23,20.32 22.48,20.07 LED1.AX
N$27  (via drill 0.51, 0.6)
  Top 0.305: v64.9,41.4 64.9,40.89 63.63,39.62 63.63,38.35 IC4.13 | R29.2 28.78,38.81 v28.83,39.12 | v30.1,50.8 v30.1,53.85
  Bottom 0.305: v64.9,41.4 64.39,41.4 63.12,40.13 57.02,40.13 51.18,45.97 51.18,51.05 48.64,53.59 41.28,53.59 38.73,51.05 38.73,49.53 37.47,48.26 36.45,48.26 33.91,50.8 33.91,52.83 32.89,53.85 v30.1,53.85 | v28.83,39.12 28.83,49.53 v30.1,50.8
N$28
  Top 0.305: R29.1 29.98,34.66 30.61,34.04 30.61,31.75 30.1,31.24 28.07,31.24 27.05,30.23 27.05,20.55 LED1.AR
N$33
  Top 0.305: IC4.7 85.76,33.31 86.74,34.29 86.74,35.29 C14.1 86.52,39.84 86.38,39.98 Q1.2
N$34
  Top 0.305: 54.48,33.33 44.27,33.33 41.28,36.32 40.02,36.32 C8.1 39.75,36.32 35.43,36.32 34.16,35.05 | 54.48,33.33 54.51,33.33 | IC4.27 54.48,33.27 54.48,33.33 | 34.16,35.05 36.45,32.77 36.45,32.26 L1.1 | C7.+ 34.16,35.05
N$35
  Top 0.305: LED2.A 97.16,37.08 97.16,34.16 97.28,34.04 R21.1
N$36  (via drill 0.51)
  Top 0.305: v98.68,12.45 D1.A | IC2.1 87.76,6.48 v89.03,7.75
  Bottom 0.305: v98.68,12.45 97.92,12.45 93.22,7.75 v89.03,7.75
N$37
  Top 0.305: IC4.8 74.74,34.11 C13.1 76.14,39.69 Q1.1
N$42
  Top 0.305: JP5.1 3.43,45.21 3.43,38.61 5.21,36.83 5.21,27.94 3.18,25.91 G1.+
N$43
  Bottom 0.305: IC1.12 26.8,30.99 26.8,32 IC1.11
N$44
  Bottom 0.305: IC1.1 20.7,28.19 23.75,28.19 25.02,26.92 29.84,26.92 30.35,27.43 30.35,33.27 27.81,35.81 26.8,35.81 IC1.8
N$45
  Bottom 0.305: IC1.3 20.45,30.73 17.15,30.73 14.1,27.69 SL1.2
N$46
  Bottom 0.305: IC1.4 20.7,32.26 20.7,33.27 IC1.5
N$47  (via drill 0.51)
  Top 0.305: v16.89,39.62 16.89,41.84 R8.1
  Bottom 0.305: v16.89,39.62 15.75,39.62 13.97,37.85 SL1.6
N$48  (3 unrouted)
N$49  (via drill 0.51)
  Top 0.305: v25.53,16.64 28.7,13.46 31.62,13.46 34.42,16.26 37.21,16.26 37.72,15.75 OK1.2
  Bottom 0.305: v25.53,16.64 17.53,16.64 16.38,15.49 16.38,14.82 R17.2
  Bottom 0.406: R17.2 16.64,14.77
N$50  (1 unrouted)
N$51  (via drill 0.51)
  Top 0.305: v28.58,29.59 29.59,29.59 35.18,24 OK1.4 33.66,22.35 32.89,21.59 32.89,19.05 32.45,18.61 R12.1
  Bottom 0.305: v28.58,29.59 26.8,29.59 IC1.13
N$52  (2 unrouted)
N$53  (2 unrouted)
N$54  (via drill 0.51)
  Top 0.305: v19.18,48.51 18.67,49.02 16.64,49.02 IC6.7
  Bottom 0.305: v19.18,48.51 9.78,48.51 6.48,45.21 JP5.2
N$55  (2 unrouted)
N$56  (via drill 0.51)
  Top 0.305: v69.47,44.45 69.47,38.35 66.93,35.81 66.17,35.81 IC4.10 | v74.8,56.9 82.93,56.9 83.19,57.15 v89.03,57.15 | R25.2 104.77,44.7 v103.25,46.23 101.47,44.45 100.2,44.45 IC5.4
  Bottom 0.305: v69.47,44.45 69.47,46.23 74.8,51.56 v74.8,56.9 | v89.03,57.15 89.03,56.64 89.79,55.88 89.79,51.56 91.82,49.53 95.88,49.53 99.19,46.23 v103.25,46.23
N$58  (4 unrouted)
N$60
  Top 0.305: IC4.29 43.65,31.71 41.28,29.34 39.99,29.34 C15.1
N$61  (via drill 0.51)
  Top 0.305: v73.79,45.21 76.83,45.21 77.34,44.7 v89.53,44.7 | v91.57,43.94 92.07,43.94 92.58,44.45 | 92.58,44.45 93.09,44.96 R24.2 92.58,44.45 | 92.58,44.45 96.39,44.45 IC5.1 | IC4.9 67.55,34.91 v69.22,36.58
  Bottom 0.305: v69.22,36.58 69.22,40.64 v73.79,45.21 | v89.53,44.7 90.8,44.7 v91.57,43.94
OPT1A  (via drill 0.51)
  Top 0.305: v67.18,37.59 66.17,36.58 IC4.11 | v90.8,41.15 90.8,35.31 84.2,28.7 v83.69,28.7 | v72.9,11.05 v79.5,17.65 | v62.36,10.67 55.63,10.67 v54.99,11.3 | v33.91,17.4 v38.1,17.4
  Bottom 0.305: v67.18,37.59 67.18,37.21 68.83,35.56 69.6,35.56 70.23,36.2 70.23,40.39 73.02,43.18 88.77,43.18 v90.8,41.15 | v83.69,28.7 83.69,27.81 81.41,25.53 81.41,19.56 v79.5,17.65 | v72.9,11.05 71.63,11.05 71.25,11.43 64.64,11.43 64.26,11.81 63.5,11.81 v62.36,10.67 | v54.99,11.3 47.75,11.3 45.97,13.08 44.32,13.08 43.94,12.7 41.28,12.7 39.75,14.22 39.75,15.75 v38.1,17.4 | IC1.2 20.45,29.59 19.56,29.59 18.67,28.7 18.67,27.18 23.24,22.61 28.7,22.61 v33.91,17.4
OPT1B  (via drill 0.51)
  Top 0.305: v68.45,42.42 64.39,38.35 IC4.12 | v82.93,25.65 v92.58,35.31 | v79.5,16.26 73.28,10.03 v72.01,10.03 | v63.88,10.79 63.63,10.79 62.74,11.68 v56.39,11.68 | v48.13,12.32 48.13,11.05 v45.85,8.76 | v27.3,9.53 15.11,9.53 9.02,15.62 9.02,27.94 10.29,29.21 10.29,30.48 11.3,31.5 16.76,31.5 v18.67,33.4
  Bottom 0.305: v68.45,42.42 69.72,42.42 72.77,45.47 72.77,45.59 73.41,46.23 75.69,46.23 78.1,43.81 89.03,43.81 90.68,42.16 91.19,42.16 92.58,40.77 v92.58,35.31 | v82.93,25.65 82.93,19.68 v79.5,16.26 | v72.01,10.03 71.75,10.03 70.99,10.79 v63.88,10.79 | v56.39,11.68 56.01,11.68 55.37,12.32 v48.13,12.32 | v45.85,8.76 44.83,7.75 34.42,7.75 32.64,9.53 v27.3,9.53 | v18.67,33.4 19.94,34.67 20.45,34.67 IC1.6
OPT2  (via drill 0.51)  (1 unrouted)
  Top 0.305: v52.96,8.64 53.21,8.89 65.41,8.89 71.25,14.73 71.25,21.34 70.74,21.84 66.67,21.84 62.73,25.79 IC4.42 | 13.84,29.97 12.57,29.97 10.03,27.43 10.03,16 v12.57,13.46
  Bottom 0.305: v52.96,8.64 48.39,8.64 47.37,7.37 47.37,3.56 46.36,2.79 23.24,2.79 v12.57,13.46
PE  (via drill 0.51)
  Top 0.305: J1.4 89.03,55.12 92.07,58.17 v93.6,58.17
  Bottom 0.305: v93.6,58.17 94.36,58.17 97.92,54.61 101.98,54.61 106.55,50.04 106.55,49.78 | 69.47,19.68 D3.A 69.47,19.64 69.47,18.29 68.71,17.53 68.71,16.51 69.85,15.37 74.55,15.37 D2.A
  Bottom 0.61: D4.3 106.55,49.78 107.82,49.78 109.85,47.75 109.85,17.27 106.05,13.46 99.69,13.46 97.92,15.24
  Bottom 0.813: D2.A 77.39,15.19 77.85,14.73 80.39,14.73 80.9,15.24 97.92,15.24 98.17,15.24 SJ2.2
PWML  (via drill 0.51)
  Top 0.305: v106.43,31.12 107.44,30.1 107.44,27.56 104.01,24.13 100.2,24.13 99.44,24.89 IC3.3
  Bottom 0.305: v106.43,31.12 106.43,35.18 104.9,36.7 SV1.9
PWMO  (via drill 0.51)
  Top 0.305: v66.93,46.99 61.09,41.15 61.09,38.35 IC4.16 | IC3.2 95.88,23.62 95,24.51 95,26.54 95.88,27.43 IC3.5 v98.3,27.43
  Bottom 0.305: v98.3,27.43 94.49,27.43 90.93,30.99 90.93,32.26 93.6,34.92 93.6,43.31 90.93,45.97 76.83,45.97 75.95,46.86 73.15,46.86 70.48,44.2 70.48,44.07 69.85,43.43 69.09,43.43 66.93,45.59 v66.93,46.99
PWMR
  Top 0.305: SV1.3 104.77,29.08 103.63,27.94 103.63,26.29 102.74,25.4 100.46,25.4 99.69,26.16 IC3.4
REDE  (via drill 0.51)
  Top 0.305: IC5.2 97.66,44.45 98.93,44.45 IC5.3 98.93,43.18 98.17,42.42 98.17,41.53 R23.2 98.17,41.4 96.9,40.13 94.74,40.13 91.57,36.96 91.57,35.18 83.06,26.67 v76.45,26.67 | v63.12,24 61.21,25.91 61.21,26.67 IC4.40
  Bottom 0.305: v63.12,24 64.39,24 67.06,26.67 v76.45,26.67
REL
  Bottom 0.305: R15.2 102.49,41.78 104.9,39.37 SV1.11
RES  (via drill 0.51)
  Top 0.305: IC4.4 73.61,30.91 77.09,27.43 80.39,27.43 | v96.9,16.51 100.71,16.51 v108.58,24.38 | v91.57,51.31 90.8,51.31 88.27,48.77 80.9,48.77 80.64,48.51 72.77,48.51 67.18,54.1 67.18,56.39 v62.87,60.71 | v46.86,57.66 v46.86,61.72 | 80.39,27.43 80.63,27.43 R13.2 | v80.39,22.61 86.61,22.61 v90.42,18.8 | v80.39,27.69 80.39,27.43
  Bottom 0.305: 32.64,57.15 22.73,57.15 21.97,57.91 21.97,58.93 21.21,59.69 20.19,59.69 18.92,60.96 JP1.5 | 32.64,57.15 JP2.6 | v108.58,24.38 108.58,42.42 103.25,47.75 98.68,47.75 95.12,51.31 v91.57,51.31 | v62.87,60.71 59.82,63.75 48.9,63.75 v46.86,61.72 | v46.86,57.66 45.85,57.66 45.34,57.15 32.64,57.15 | v80.39,22.61 v80.39,27.69 | v90.42,18.8 92.84,18.8 95.12,16.51 v96.9,16.51
SCK  (via drill 0.51)
  Top 0.305: v47.12,52.07 41.02,58.17 41.02,61.21 v39.24,62.99 | IC6.6 16.64,47.75 18.41,47.75 18.67,47.5 19.69,47.5 20.7,48.51 20.7,54.1 24.77,57.91 24.77,58.67 23.75,59.69 22.23,59.69 20.95,60.96 JP1.3 | IC4.3 66.17,29.97 68.2,29.97 v68.45,29.72
  Bottom 0.305: v68.45,29.72 65.41,29.72 47.12,48.01 v47.12,52.07 | v39.24,62.99 37.72,62.99 36.7,64.01 24,64.01 20.95,60.96 JP1.3
SET_K  (via drill 0.51)
  Top 0.305: S3.4 22.73,48.77 22.73,42.67 S3.3 22.73,42.42 22.73,41.15 23.75,40.13 28.32,40.13 29.08,40.89 29.08,41.91 29.34,42.16 30.55,42.16 R3.1 | v41.78,26.92 45.85,30.99 54.48,30.99 IC4.30 | R3.1 30.86,42.16 | R3.1 30.86,42.05 30.86,40.13 32.13,38.86 32.13,28.45 34.67,25.91 35.43,25.91 v35.69,25.65
  Bottom 0.305: v41.78,26.92 41.28,26.92 40.01,25.65 v35.69,25.65
SM1  (via drill 0.51)
  Top 0.305: v107.57,33.27 109.6,31.24 109.6,13.46 107.19,11.05 99.19,11.05 97.03,8.89 97.03,6.48 94.61,4.06 R7.1
  Bottom 0.305: v107.57,33.27 107.57,36.83 107.44,36.83 106.17,38.1 104.39,38.1 103.25,39.24 102.36,39.24 SV1.12
SM2  (via drill 0.51)
  Top 0.305: v108.97,11.43 108.97,11.94 110.24,13.21 110.24,32 107.95,34.29 106.55,34.29 105.28,33.02 104.39,33.02 103.63,33.78 103.63,35.43 102.36,36.7 SV1.10 | IC2.5 v84.33,10.29
  Bottom 0.305: v84.33,10.29 89.41,5.21 92.71,5.21 98.93,11.43 v108.97,11.43
TCK  (via drill 0.51)
  Top 0.305: v51.44,39.62 56.52,39.62 57.02,39.12 57.02,38.35 IC4.21 | v46.61,40.13 46.61,51.05 40.26,57.4 40.26,59.69 JP2.1
  Bottom 0.305: v51.44,39.62 47.12,39.62 v46.61,40.13
TDI  (via drill 0.51)
  Top 0.305: v51.18,35.81 54.48,35.81 IC4.24 | v27.81,52.32 27.56,52.58 27.56,59.69 JP2.9
  Bottom 0.305: v51.18,35.81 48.13,35.81 44.32,39.62 43.31,39.62 30.61,52.32 v27.81,52.32
TDO  (via drill 0.51)
  Top 0.305: v51.18,37.34 51.94,36.58 54.48,36.58 IC4.23 | v41.78,52.58 41.78,53.09 37.72,57.15 37.72,59.69 JP2.3
  Bottom 0.305: v51.18,37.34 47.62,37.34 44.58,40.39 44.07,40.39 41.78,42.67 v41.78,52.58
THR  (via drill 0.51)
  Top 0.305: IC4.34 55.91,26.71 C6.2 52.71,23.37 51.94,23.37 49.91,21.34 49.91,20.32 51.44,18.8 R6.2 51.31,13.97 49.91,13.97 v49.66,13.72 | v43.56,13.72 42.04,12.19 42.04,9.65 T1.1 42.04,9.53 42.04,8.76 46.86,3.94 v52.96,3.94 | v83.06,7.75 83.06,8.51 83.44,8.89 86.17,8.89 IC2.3
  Bottom 0.305: v43.56,13.72 v49.66,13.72 | v83.06,7.75 79.12,7.75 72.9,1.52 53.98,1.52 52.96,2.54 v52.96,3.94
TMS  (via drill 0.51)
  Top 0.305: v50.16,38.35 56.26,38.35 IC4.22 | v35.69,45.72 35.69,57.4 35.18,57.91 35.18,59.69 JP2.5
  Bottom 0.305: v50.16,38.35 51.69,38.35 52.2,37.85 52.2,35.31 51.69,34.8 48.13,34.8 44.07,38.86 42.55,38.86 v35.69,45.72
ULED  (via drill 0.51)
  Top 0.305: v54.74,7.24 54.74,4.32 53.34,2.92 44.45,2.92 37.59,9.78 30.1,9.78 26.67,13.21 22.48,13.21 15.11,20.57 v12.45,20.57 | v70.61,9.78 70.61,10.29 75.18,14.86 75.18,18.8 80.01,23.62 86.74,23.62 87.38,24.26 87.38,28.96 89.79,31.37 v91.95,31.37 | R8.2 19.62,40.7 v18.54,39.62
  Bottom 0.305: v54.74,7.24 55.25,7.24 57.02,9.02 67.44,9.02 67.82,8.64 69.47,8.64 v70.61,9.78 | v91.95,31.37 99.31,31.37 102.23,34.29 SV1.8 | v18.54,39.62 18.41,39.5 18.41,37.08 17.78,36.45 11.94,36.45 11.05,35.56 11.05,23.88 12.32,22.61 12.32,20.7 v12.45,20.57
UMON  (via drill 0.51)
  Top 0.305: 97.28,20.57 v95.5,20.57 | 97.28,20.57 v103.38,20.57 | 59.94,20.57 58.8,21.72 58.8,26.67 IC4.37 | 59.94,20.57 v61.34,20.57 | v77.98,20.19 77.98,20.57 78.99,21.59 86.23,21.59 90.3,17.53 94.36,17.53 97.28,20.45 97.28,20.57 | 59.94,20.57 59.94,17.08 C1.2
  Bottom 0.305: v103.38,20.57 106.55,17.4 R4.1 | v95.5,20.57 95.5,20.07 94.49,19.05 R5.2 | v61.34,20.57 61.85,20.57 65.28,24 69.34,24 71.5,21.84 71.5,20.7 72.01,20.19 v77.98,20.19
UP_K  (via drill 0.51)
  Top 0.305: 42.04,19.3 44.32,17.02 S1.3 | 42.04,19.3 41.28,20.07 41.28,20.83 R1.1 | v48.64,29.21 54.48,29.21 IC4.32 | 42.04,19.3 v42.29,19.56
  Bottom 0.305: v48.64,29.21 44.58,25.15 44.58,23.62 S1.4 44.32,23.37 42.29,21.34 v42.29,19.56
VCC  (via drill 0.51)
  Top 0.305: IC4.5 74.48,31.71 76.63,29.57 77.71,29.57 C10.1 79.54,29.12 | IC4.17 60.33,47.08 C11.1 59.82,48.01 59.82,51.82 C9.+ | 14.86,50.04 14.03,49.21 C19.1 14.1,43.69 15.88,41.91 15.88,38.61 | 14.86,50.04 15.11,50.29 16.52,50.29 IC6.8 | R1.2 41.02,22.86 41.02,24.64 36.45,29.21 L1.2 | R6.1 51.44,12.19 49.66,12.19 45.59,16.26 45.59,18.54 41.28,22.86 R1.2 | 40.51,47.24 35.69,42.42 32.64,42.42 R3.2 | JP2.4 36.45,51.31 37.21,50.55 | 37.21,50.55 40.51,47.24 | 40.51,47.24 R2.2 | 14.86,50.04 14.86,53.09 R26.2 14.86,53.34 18.16,53.34 23.24,58.42 JP1.2 | 15.88,38.61 15.88,34.54 14.1,32.77 SL1.4 | 15.88,38.61 v24.51,38.61 | 37.21,50.55 v36.7,50.04 | v57.02,52.07 C9.+ | 79.54,29.12 81.15,30.73 82.03,30.73 R13.1 | 65.28,17.14 65.28,19.56 v62.36,22.48 | v60.33,21.59 60.33,22.1 59.56,22.86 59.56,26.67 IC4.38 | 86.11,14.22 91.06,14.22 93.09,12.19 R11.1 92.96,12.07 91.69,10.79 91.69,6.22 90.68,5.21 85.72,5.21 84.45,6.48 IC2.8 | 85.72,14.22 86.11,14.22 | 85.72,14.22 84.07,14.22 82.8,12.95 C3.1 | v66.8,17.14 65.28,17.14 | 86.11,14.22 v86.11,13.08 | v79.76,28.96 79.63,29.08 79.54,29.12 | SV1.2 102.23,26.67 101.22,26.67 99.95,27.94 99.95,31.24 98.68,32.51 96.27,32.51 96.07,32.32 | 95,42.55 96.14,41.4 R23.1 | 95,42.55 94.61,42.93 93.09,42.93 R24.1 92.96,42.93 91.19,42.93 90.55,43.56 90.55,45.97 | 90.61,47.31 90.55,47.37 90.55,48.13 92.58,50.16 93.09,50.16 C4.1 96.25,50.3 IC5.8 | 90.61,47.31 91.19,46.74 99.82,46.74 100.33,47.24 104.39,47.24 106.05,45.59 106.05,44.2 105.66,43.81 105.54,43.81 104.77,43.05 R25.1 | 90.55,45.97 90.55,47.24 90.61,47.31 | v95.38,39.12 95.38,34.16 R21.2 95.5,34.04 95.5,32.89 96.07,32.32
  Top 0.305: 95,42.55 v95.38,42.93 | R1.2 40.89,22.86 39.24,21.21 35.43,21.21 v34.04,19.81 34.23,19.62 | v29.34,28.45 29.59,28.19 v29.59,24.26 29.59,23.37 30.86,22.1 R12.2 | 90.55,45.97 74.42,45.97 68.71,51.69 59.94,51.69 C9.+ | v92.71,21.21 92.71,22.1 93.22,22.61 93.22,29.46 96.07,32.32 | 65.28,17.14 62.6,17.14 C12.1 | v79.38,20.57 84.71,20.57 85.72,19.56 85.72,14.22
  Bottom 0.305: IC1.14 26.59,28.45 24.38,28.45 23,29.84 C2.1 23.24,38.61 v24.51,38.61 | JP2.4 35.69,58.42 34.42,59.69 32.64,59.69 JP2.7 30.61,60.96 29.34,59.69 24.77,59.69 23.5,58.42 JP1.2 | IC1.14 26.8,28.19 | v57.02,52.07 51.18,52.07 48.9,54.36 41.02,54.36 v36.7,50.04 | v62.36,22.48 61.21,22.48 v60.33,21.59 | v86.11,13.08 85.98,12.95 67.94,12.95 66.93,13.97 66.93,17.02 v66.8,17.14 | v79.38,20.57 79.38,28.07 79.76,28.45 v79.76,28.96 82.55,28.96 83.31,29.72 84.07,29.72 85.34,28.45 85.34,24.26 89.41,20.19 91.69,20.19 v92.71,21.21 | v95.38,42.93 v95.38,39.12 | v29.34,28.45 26.8,28.45 IC1.14 | v29.59,24.26 v34.04,19.81
VDD
  Top 0.305: C18.1 91.82,18.8 90.3,20.32 90.3,22.33 IC3.14
VSS
  Top 0.305: IC3.7 94.61,29.97 93.85,29.21 93.85,18.86 C18.2

### Text on the board
tNames: ISP | Volt | mA | TER | JTAG | RS-485 | BAT | SENSOR | T1 | INPUT
bNames: SET | DOWN | UP | IMOT | TEMP